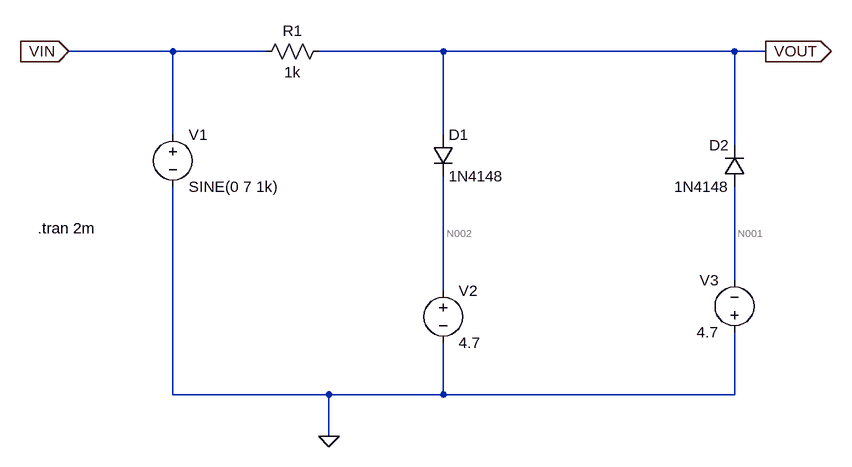
[diagram p0: schematic exp2_b.asc]
exp2_b.asc, the LTspice schematic file:
Version 4
SHEET 1 1036 680
WIRE 0 16 -160 16
WIRE 144 16 0 16
WIRE 416 16 224 16
WIRE 864 16 416 16
WIRE 912 16 864 16
WIRE 0 144 0 16
WIRE 416 144 416 16
WIRE 864 160 864 16
WIRE 864 368 864 224
WIRE 416 384 416 208
WIRE 0 544 0 224
WIRE 240 544 0 544
WIRE 416 544 416 464
WIRE 416 544 240 544
WIRE 864 544 864 448
WIRE 864 544 416 544
WIRE 240 608 240 544
FLAG 240 608 0
FLAG -160 16 VIN
IOPIN -160 16 In
FLAG 912 16 VOUT
IOPIN 912 16 Out
SYMBOL voltage 0 128 R0
WINDOW 123 0 0 Left 2
WINDOW 39 0 0 Left 2
SYMATTR InstName V1
SYMATTR Value SINE(0 7 1k)
SYMBOL res 240 0 R90
WINDOW 0 0 56 VBottom 2
WINDOW 3 32 56 VTop 2
SYMATTR InstName R1
SYMATTR Value 1k
SYMBOL diode 400 144 R0
SYMATTR InstName D1
SYMATTR Value 1N4148
SYMBOL diode 880 224 R180
WINDOW 0 24 64 Left 2
WINDOW 3 24 0 Left 2
SYMATTR InstName D2
SYMATTR Value 1N4148
SYMBOL voltage 416 368 R0
WINDOW 123 0 0 Left 2
WINDOW 39 0 0 Left 2
SYMATTR InstName V2
SYMATTR Value 4.7
SYMBOL voltage 864 464 R180
WINDOW 0 24 96 Left 2
WINDOW 3 24 16 Left 2
WINDOW 123 0 0 Left 2
WINDOW 39 0 0 Left 2
SYMATTR InstName V3
SYMATTR Value 4.7
TEXT -208 288 Left 2 !.tran 2m

The netlist it stands for:
* exp2_b.asc
V1 VIN 0 SINE(0 7 1k)
R1 VOUT VIN 1k
D1 VOUT N002 1N4148
D2 N001 VOUT 1N4148
V2 N002 0 4.7
V3 0 N001 4.7
.model D D
.lib standard.dio
.tran 2m
.backanno
.end

* Results of the author's LTspice run, read from the files saved beside the schematic
* Operating Point, zero values left out:
*   V(n002) = 4.7 V
*   V(n001) = -4.7 V
*   I(D2) = -2.525 nA
*   I(D1) = -2.525 nA
*   I(V3) = -2.525 nA
*   I(V2) = -2.525 nA
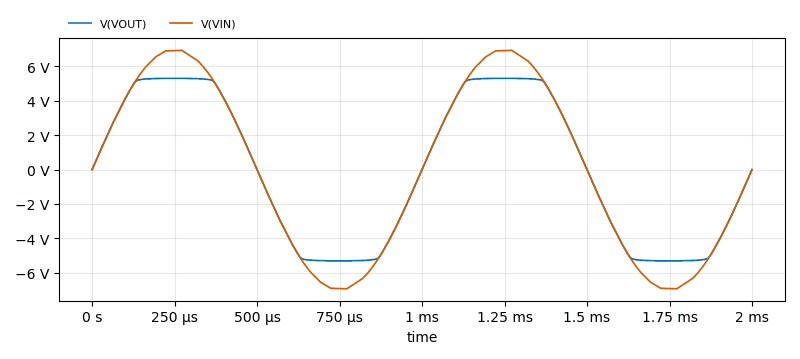
[diagram p1: Transient Analysis of exp2_b.asc, plotted from the saved traces]
* Transient Analysis, 1 run:
*   V(VOUT): min -5.307 V, max 5.307 V, average 10.3 µV, rms 4.288 V, last -174.9 µV
*   V(VIN): min -6.932 V, max 6.932 V, average 10.28 µV, rms 4.94 V, last 0 V